# EAGLE design Breakout (EAGLE 9.6.2)
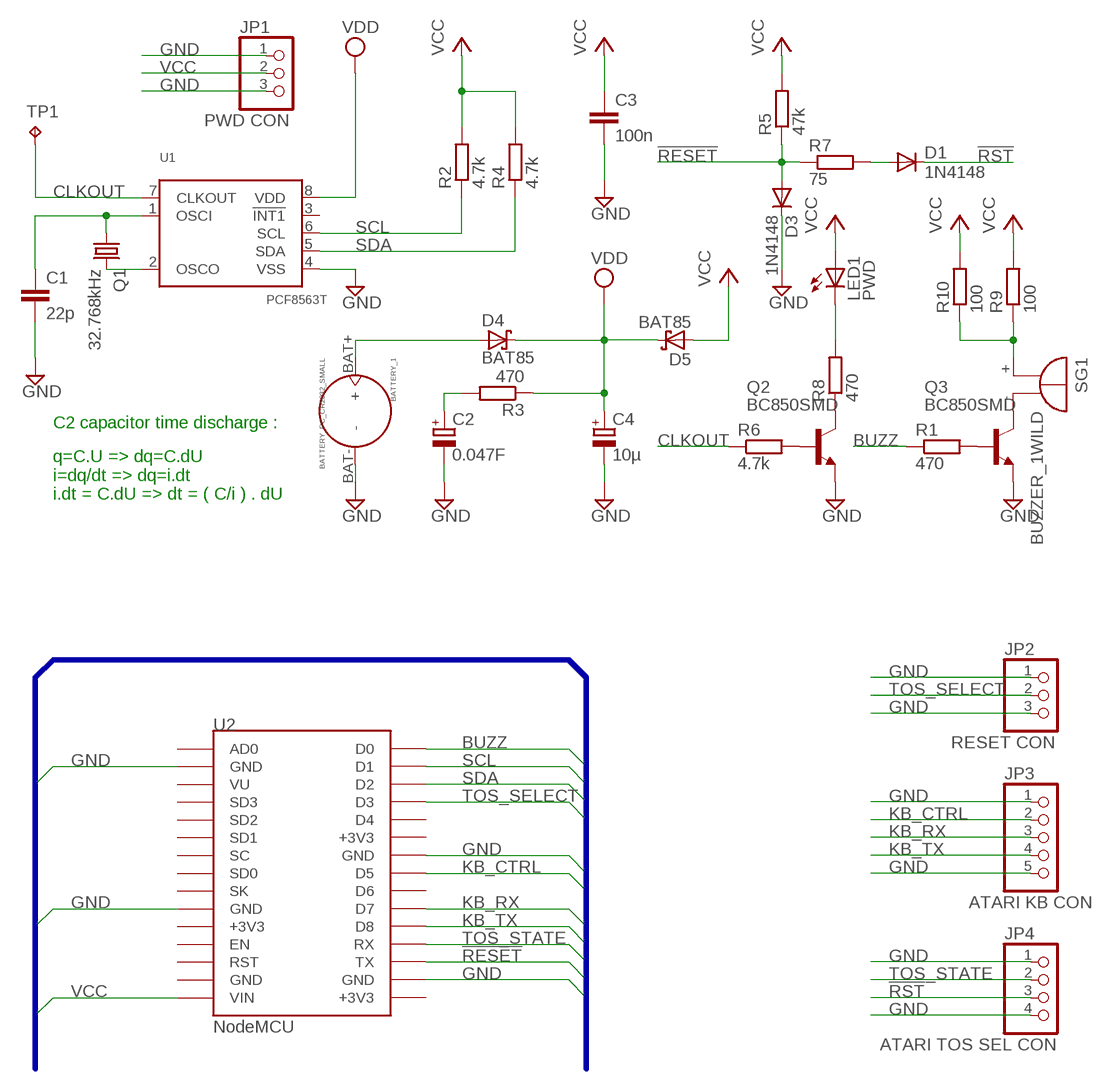
[diagram p0: schematic, sheet 1]

## Parts
BATTERY_1  BATTERY_PC_CR2032_SMALL  [BATTERY_1236_SMALL]
C1  22p  C-EU025-024X044  [C025-024X044]
C2  0.047F  SUPERCAP  [SCAP1]
C3  100n  C-EU050-025X075  [C050-025X075]
C4  10µ  CPOL-EUE2-5  [E2-5]
D1  1N4148  1N4148DO35-5  [DO35-5]
D3  1N4148  1N4148DO35-7  [DO35-7]
D4  BAT85  [DO41-10]
D5  BAT85  [DO41-10]
JP1  PWD CON  PINHD-1X3  [1X03]
JP2  RESET CON  PINHD-1X3  [1X03]
JP3  ATARI KB CON  PINHD-1X5  [1X05]
JP4  ATARI TOS SEL CON  PINHD-1X4  [1X04]
LED1  PWD  LED5MM  [LED5MM]
Q1  32.768kHz  CRYSTALTC38H  [TC38H]
Q2  BC850SMD  [SOT23-BEC]
Q3  BC850SMD  [SOT23-BEC]
R1  470  R-EU_M2012  [M2012]
R2  4.7k  R-EU_0204/7  [0204/7]
R3  470  R-EU_0204/7  [0204/7]
R4  4.7k  R-EU_0204/7  [0204/7]
R5  47k  R-EU_0204/7  [0204/7]
R6  4.7k  R-EU_0204/7  [0204/7]
R7  75  R-EU_0204/7  [0204/7]
R8  470  R-EU_M2012  [M2012]
R9  100  R-EU_M2012  [M2012]
R10  100  R-EU_0207/7  [0207/7]
SG1  BUZZER_1WILD  [F/QMBIII-W]
TP1  TPTP19SQ  [TP19SQ]
U1  PCF8563T  [SOT96-1]
U2  NodeMCU  NODE_MCU_V3DIL_WILD  [NODE_MCU_V3_WILD_DIL]

## Nets
!RESET: D3.A R5.1 R7.1 U2.TX
!RST: D1.C JP4.3
BUZZ: R1.1 U2.D0
CLKOUT: R6.1 TP1.TP U1.7(CLKOUT)
GND: BATTERY_1.BAT-(-) C1.2 C2.- C3.2 C4.- D3.C JP1.1 JP1.3 JP2.1 JP2.3 JP3.1 JP3.5 JP4.1 JP4.4 Q2.E Q3.E U1.4(VSS) U2.GND U2.GND@0(GND) U2.GND@2(GND) U2.GND@3(GND)
KB_CTRL: JP3.2 U2.D5
KB_RX: JP3.3 U2.D7
KB_TX: JP3.4 U2.D8
N$1: C1.1 Q1.1 U1.1(OSCI)
N$2: Q1.2 U1.2(OSCO)
N$3: Q2.B R6.2
N$4: LED1.K(C) R8.2
N$5: Q2.C R8.1
N$6: Q3.B R1.2
N$7: BATTERY_1.BAT+(+) D4.A
N$8: C2.+ R3.2
N$10: Q3.C SG1.-
N$13: D1.A R7.2
N$18: R9.1 R10.1 SG1.+
SCL: R2.1 U1.6(SCL) U2.D1
SDA: R4.1 U1.5(SDA) U2.D2
TOS_SELECT: JP2.2 U2.D3
TOS_STATE: JP4.2 U2.RX
VCC: C3.1 D5.A JP1.2 LED1.A R2.2 R4.2 R5.2 R9.2 R10.2 U2.VIN
VDD: C4.+ D4.C D5.C R3.1 U1.8(VDD)
Unconnected: U1.3(!INT1!) U2.3V3@0(+3V3) U2.3V3@1(+3V3) U2.3V3@2(+3V3) U2.AD0 U2.D4 U2.D6 U2.EN U2.GND@1(GND) U2.RST U2.SC U2.SD0 U2.SD1 U2.SD2 U2.SD3 U2.SK U2.VU

## Buses
+3V3,BUZZ,GND,KB_CTRL,KB_RX,KB_TX,!RESET,SCL,SDA,TOS_SELECT,TOS_STATE,VCC

## Notes on the sheet
- C2 capacitor time discharge :
- q=C.U => dq=C.dU
  i=dq/dt => dq=i.dt
  i.dt = C.dU => dt = ( C/i ) . dU

## Library data of the parts
BATTERY_1 = Custom:BATTERY_PC_CR2032: SOC004
C1 C3 = Custom:C-EU: CAPACITOR, European symbol
C2 = Custom:SUPERCAP
C4 = Custom:CPOL-EU: POLARIZED CAPACITOR, European symbol
D1 D3 = Custom:1N4148: DIODE high speed (Philips)
D4 D5 = Custom:BAT85: DIODE small signal diode
JP1 JP2 = pinhead:PINHD-1X3: PIN HEADER
JP3 = pinhead:PINHD-1X5: PIN HEADER
JP4 = pinhead:PINHD-1X4: PIN HEADER
LED1 = Custom:LED: LED OSRAM: - CHIPLED LG R971, LG N971, LY N971, LG Q971, LY Q971, LO R971, LY R971 LH N974, LH R974 LS Q976, LO Q976, LY Q976 LO Q996 - Hyper CHIPLED LW Q18S LB Q993, LB Q99A, LB R99A - SideLED LS A670, LO A670, LY A670, LG A670, LP A670 LB A673, LV A673, LT A673, LW A673 LH A674 LY A675 LS A676, LA A676, LO A676, LY A676, LW A676 LS A679, LY A679, LG A679 - Hyper Micro SIDELED® LS Y876, LA Y876, LO Y876, LY Y876 LT Y87S - SmartLED LW L88C, LW L88S LB L89C, LB L89S, LG L890 LS L89K, LO L89K, LY L89K LS L896, LA L896, LO L896, LY L896 - TOPLED LS T670, LO T670, LY T670, LG T670, LP T670 LSG T670, LSP T670, LSY T670, LOP T670, LYG T670 LG T671, LOG T671, LSG T671 LB T673, LV T673, LT T673, LW T673 LH T674 LS T676, LA T676, LO T676, LY T676, LB T676, LH T676, LSB T676, LW T676 LB T67C, LV T67C, LT T67C, LS T67K, LO T67K, LY T67K, LW E67C LS E67B, LA E67B, LO E67B, LY E67B, LB E67C, LV E67C, LT E67C LW T67C LS T679, LY T679, LG T679 LS T770, LO T770, LY T770, LG T770, LP T770 LB T773, LV T773, LT T773, LW T773 LH T774 LS E675, LA E675, LY E675, LS T675 LS T776, LA T776, LO T776, LY T776, LB T776 LHGB T686 LT T68C, LB T68C - Hyper Mini TOPLED® LB M676 - Mini TOPLED Santana® LG M470 LS M47K, LO M47K, LY M47K Source: http://www.osram.convergy.de LUXEON: - LUMILED® LXK2-PW12-R00, LXK2-PW12-S00, LXK2-PW14-U00, LXK2-PW14-V00 LXK2-PM12-R00, LXK2-PM12-S00, LXK2-PM14-U00 LXK2-PE12-Q00, LXK2-PE12-R00, LXK2-PE12-S00, LXK2-PE14-T00, LXK2-PE14-U00 LXK2-PB12-K00, LXK2-PB12-L00, LXK2-PB12-M00, LXK2-PB14-N00, LXK2-PB14-P00, LXK2-PB14-Q00 LXK2-PR12-L00, LXK2-PR12-M00, LXK2-PR14-Q00, LXK2-PR14-R00 LXK2-PD12-Q00, LXK2-PD12-R00, LXK2-PD12-S00 LXK2-PH12-R00, LXK2-PH12-S00 LXK2-PL12-P00, LXK2-PL12-Q00, LXK2-PL12-R00 Source: www.luxeon.com KINGBRIGHT: KA-3528ASYC Source: www.kingbright.com
Q1 = Custom:CRYSTAL: CRYSTAL; OC_FARNELL: unknown; OC_NEWARK: unknown
Q2 Q3 = Custom:BC850*: NPN Transistor
R1-R10 = Custom:R-EU_: RESISTOR, European symbol
SG1 = Custom:BUZZER_1: BUZZER Source: Buerklin
TP1 = testpad:TP: Test pad
U1 = NXP_60_26022015:PCF8563: Real time clock/calendar The PCF8563 is a CMOS Real-Time Clock (RTC) and calendar optimized for low power consumption. A programmable clock output, interrupt output, and voltage-low detector are also provided. All addresses and data are transferred serially via a two-line bidirectional I2C-bus. Maximum bus speed is 400 kbit/s. The register address is incremented automatically after each written or read data byte. AAL Eindhoven MK
U2 = ESP12E_DEVKIT:NODE_MCU_V3: ESP12E DEVKIT BOARD

## Board
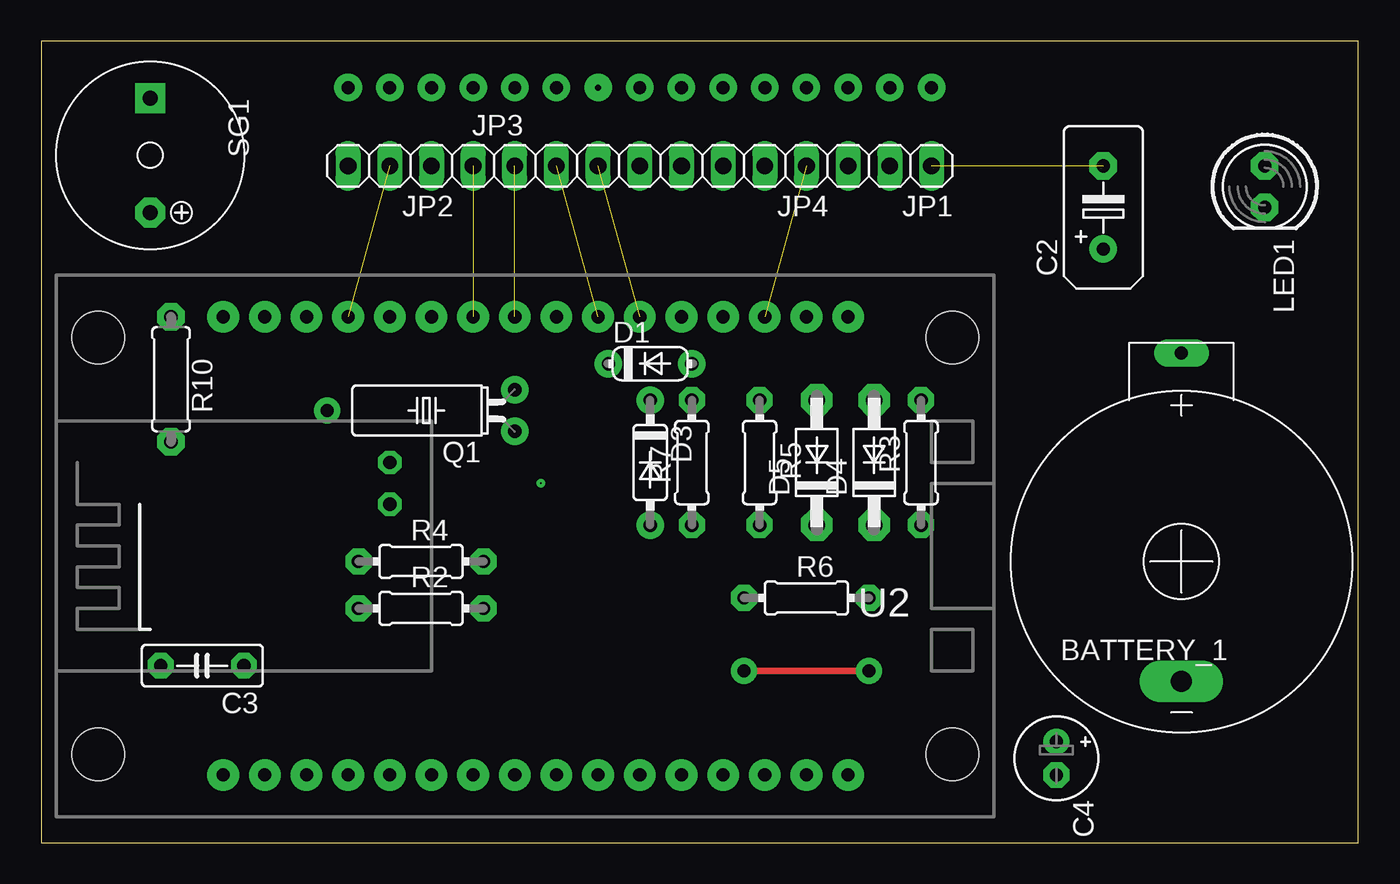
[diagram p1: board, top side]
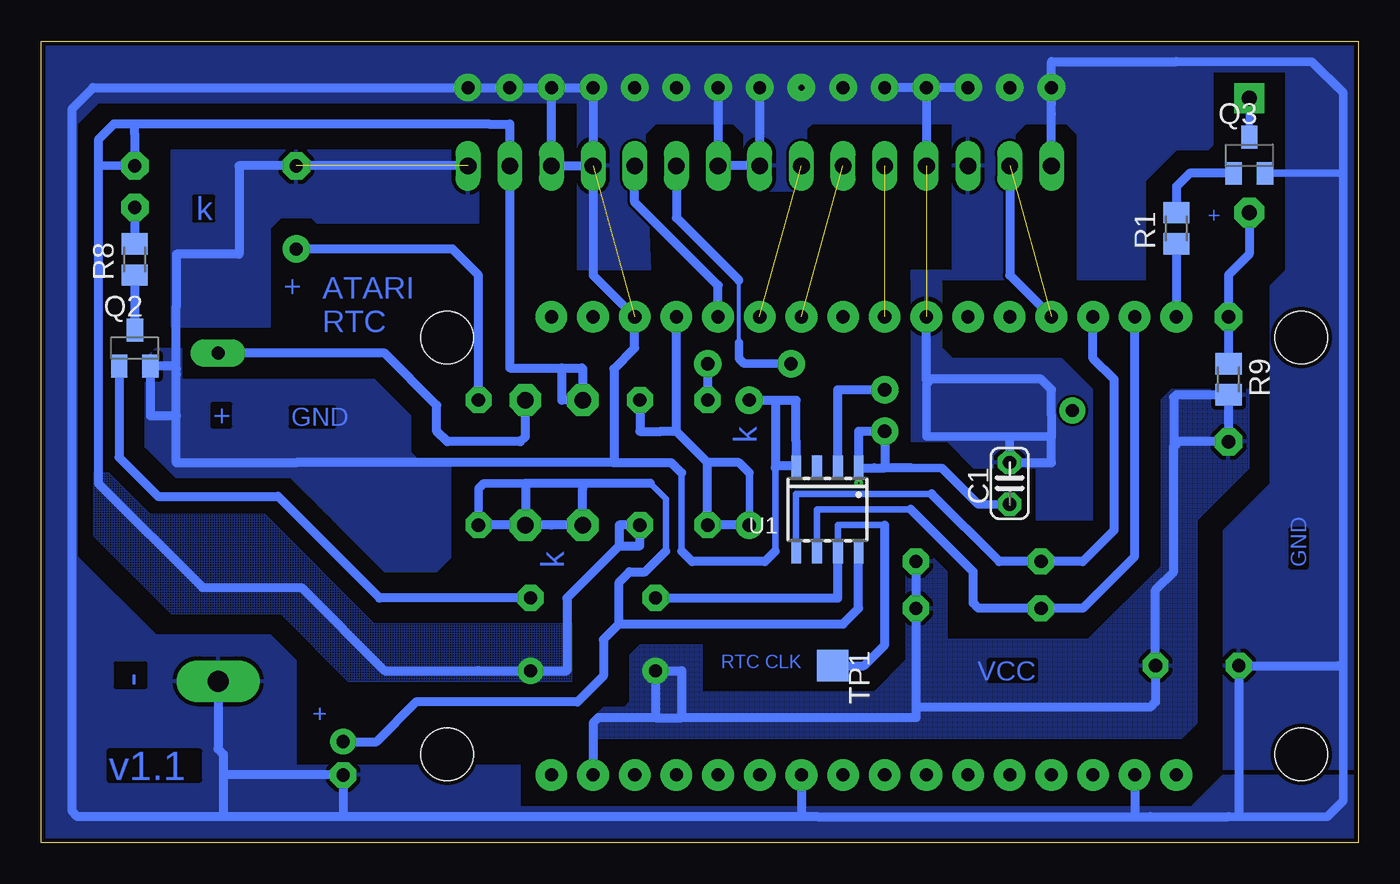
[diagram p2: board, bottom side, seen from below]

Size 80.32 x 48.88 mm. Coordinates in mm from the lower left corner, seen from the top.
Outline: 80.32,0 80.32,48.88 0,48.88 0,0 80.32,0
Copper layers (1*16): Top 0.035mm / dielectric 1.5mm / Bottom 0.035mm
Design rules "default *": minimum track width 10mil, minimum drill 0.35mm, track to track 6mil, track to pad 6mil, pad to pad 6mil, via to via 6mil, smd to smd 6mil, copper to edge 10mil, drill to drill 6mil, minimum pad ring 10mil, minimum via ring 8mil, stop-mask expansion 4mil, vias tented up to drill 0mil, thermal gap 10mil

### Footprints (pad centres in the part's own frame; a part is rotated, then mirrored left to right if it is on the bottom)
BATTERY_1236_SMALL = drill 0.8 pad 1.676 long: BAT+ 0,-0.635 | drill 1.27 pad 2.54 long: BAT- 0,19.367
C025-024X044 = drill 0.813 pad 1.422 octagon: 1 -1.27,0; 2 1.27,0
SCAP1 = drill 0.813 pad 1.676: + -7.62,0 | drill 0.813 pad 1.676 octagon: - -2.54,0
C050-025X075 = drill 0.813 pad 1.575 octagon: 1 -2.54,0; 2 2.54,0
E2-5 = drill 0.813 pad 1.575: + -1.016,0 | drill 0.813 pad 1.575 octagon: - 1.016,0
DO35-5 = drill 0.813 pad 1.676: A 2.54,0; C -2.54,0
DO35-7 = drill 0.813 pad 1.676: A 3.81,0; C -3.81,0
DO41-10 = drill 1 pad 1.93 octagon: A 3.81,0; C -3.81,0
1X03 = drill 1.016 long: 1 -2.54,0; 2 0,0; 3 2.54,0
1X05 = drill 1.016 long: 1 -5.08,0; 2 -2.54,0; 3 0,0; 4 2.54,0; 5 5.08,0
1X04 = drill 1.016 long: 1 -3.81,0; 2 -1.27,0; 3 1.27,0; 4 3.81,0
LED5MM = drill 0.813 pad 1.676 octagon: A -1.27,0; K 1.27,0
TC38H = drill 0.813 pad 1.676: 1 -1.27,0; 2 1.27,0
SOT23-BEC = smd 1 x 1.4: B -0.95,-1.1; C 0,1.1; E 0.95,-1.1
M2012 = smd 1.3 x 1.6: 1 -0.95,0; 2 0.95,0
0204/7 = drill 0.813 pad 1.575 octagon: 1 -3.81,0; 2 3.81,0
0207/7 = drill 0.813 pad 1.676 octagon: 1 -3.81,0; 2 3.81,0
F/QMBIII-W = drill 0.914 pad 1.829 octagon: + 3.493,0 | drill 0.914 pad 1.829 square: - -3.493,0
TP19SQ = smd 1.9 x 1.9: TP 0,0
SOT96-1 = smd 0.6 x 1.3: 1 -1.905,-2.65; 2 -0.635,-2.65; 3 0.635,-2.65; 4 1.905,-2.65; 5 1.905,2.65; 6 0.635,2.65; 7 -0.635,2.65; 8 -1.905,2.65
NODE_MCU_V3_WILD_DIL = drill 0.8 pad 1.93: 3V3@0 -13.97,-11.43; 3V3@1 13.97,1.27; 3V3@2 13.97,-21.59; AD0 -13.97,13.97; D0 13.97,13.97; D1 13.97,11.43; D2 13.97,8.89; D3 13.97,6.35; D4 13.97,3.81; D5 13.97,-3.81; D6 13.97,-6.35; D7 13.97,-8.89; D8 13.97,-11.43; EN -13.97,-13.97; GND -13.97,11.43; GND@0 -13.97,-8.89; GND@1 -13.97,-19.05; GND@2 13.97,-19.05; GND@3 13.97,-1.27; NC@0 -13.97,-24.13; NC@2 13.97,-24.13; RST -13.97,-16.51; RX 13.97,-13.97; SC -13.97,-1.27; SD0 -13.97,-3.81; SD1 -13.97,1.27; SD2 -13.97,3.81; SD3 -13.97,6.35; SK -13.97,-6.35; TX 13.97,-16.51; VIN -13.97,-21.59; VU -13.97,8.89 | hole 3.2: -12.7,21.59; 12.7,21.59; -12.7,-30.48; 12.7,-30.48

### Placement (x,y rotation side)
BATTERY_1  69.52,29.21 180 top
C1  21.26,21.91 90 bottom
C2  64.76,43.81 90 top
C3  9.83,10.79 180 top
C4  61.9,5.14 270 top
D1  37.14,29.21 0 top
D3  37.14,23.18 270 top
D4  50.79,23.18 90 top
D5  47.3,23.18 90 top
JP1  51.74,41.27 180 top
JP2  21.26,41.27 180 top
JP3  31.42,41.27 0 top
JP4  42.85,41.27 180 top
LED1  74.6,40.01 270 top
Q1  28.88,26.35 90 top
Q2  74.6,30.16 0 bottom
Q3  6.66,41.91 0 bottom
R1  11.1,37.47 90 bottom
R2  23.17,14.29 0 top
R3  53.65,23.18 90 top
R4  23.17,17.14 0 top
R5  43.8,23.18 270 top
R6  46.66,14.92 0 top
R7  39.68,23.18 90 top
R8  74.6,35.56 90 bottom
R9  7.93,28.26 270 bottom
R10  7.93,28.26 270 top
SG1  6.66,41.91 270 top
TP1  32.06,10.79 270 bottom
U1  32.38,20.32 180 bottom
U2  25.07,18.1 90 top

### Tracks (layer width: path | path; a pad name or v marks a point on that pad's centre or on a via)
!RESET
  Bottom 0.457: 37.14,22.54 D3.A
  Bottom 0.559: 37.14,22.54 37.77,23.18 39.68,23.18 | 39.68,23.18 41.58,25.08 | 41.58,25.08 42.54,25.08 43.8,25.08 R5.1 | D3.A R7.1 39.68,23.18 | 41.58,25.08 U2.TX
!RST
  Bottom 0.254: 37.77,30.48 37.77,34.29
  Bottom 0.508: D1.C 37.45,29.21 37.77,29.53 37.77,30.48
  Bottom 0.559: JP4.3 41.58,38.1 37.77,34.29
BUZZ
  Bottom 0.559: R1.1 U2.D0
CLKOUT
  Bottom 0.406: 28.88,19.37 31.74,19.37 U1.7
  Bottom 0.559: R6.1 31.74,14.92 U1.7 | TP1.TP 30.15,10.79 28.88,12.06 28.88,19.37
GND  (via drill 0.35 pad 1.68, 0.79 pad 1.68)  (3 unrouted)
  Bottom 0.406: 34.28,23.5 U1.4 | 35.55,17.78 35.55,22.86 35.44,22.97 | 41.27,17.78 41.27,22.54
  Bottom 0.457: 0.94,40.81 Q3.E
  Bottom 0.508: 26.03,28.26 26.34,27.94 26.34,24.77 21.26,24.77 18.72,24.77 | 7.93,1.59 7.29,1.59 5.71,1.59 1.89,1.59 0.94,2.54 0.94,5.08 0.94,10.79 0.94,39.69 0.94,40.64 0.94,41.27 | 0.94,41.27 0.94,45.72 2.85,47.62 11.1,47.62 | 0.94,41.27 0.94,40.81
  Bottom 0.559: 13.64,1.59 33.01,1.59 33.96,1.59 | 13.64,1.59 12.69,1.59 7.93,1.59 | 61.9,1.59 C4.- 69.2,4.13 69.2,5.4 | v49.2,46.04 v51.74,46.04 v54.28,46.04 77.14,46.04 78.41,44.77 78.41,1.91 78.09,1.59 69.2,1.59 | v49.2,46.04 v46.66,46.04 46.66,44.77 46.66,44.45 46.66,41.91 JP4.1 | 69.2,1.59 66.98,1.59 62.22,1.59 61.9,1.59 | 34.28,23.5 34.28,24.45 34.28,26.99 35.55,26.99 | D3.C 35.87,26.99 35.55,26.99 | 35.55,17.78 36.19,17.14 40.63,17.14 41.27,17.78 | 41.27,22.54 41.9,23.18 45.39,23.18 | 35.55,26.99 35.55,22.86 | 45.39,23.18 64.76,23.18 72.06,23.18 72.06,26.04 | v28.88,46.04 28.57,46.04 v26.34,46.04 | JP2.3 18.72,44.45 18.72,45.09 v18.72,46.04 18.72,46.36 18.72,47.62 11.1,47.62 | v23.8,46.04 v26.34,46.04 | 45.39,23.18 45.39,28.89 44.12,30.16 U2.GND@2 46.66,34.61 JP4.1 | U1.4 35.44,22.97 | v39.04,46.04 39.04,43.5 JP4.4 JP3.5 v36.5,46.04 | v26.34,46.04 JP3.1 | v49.2,46.04 JP1.3 JP4.1 | U2.GND 13.64,1.59 | 0.94,10.79 1.26,10.79 C3.2 7.29,1.59 | U2.GND@3 26.34,28.26 26.03,28.26 19.36,28.26 18.72,27.62 18.72,26.04 18.72,24.77 18.72,23.18 C1.2 21.26,24.77 | 33.96,1.59 44.12,1.59 61.9,1.59 | 72.06,26.04 72.38,26.04 73.65,26.04 Q2.E 72.23,29.06 72.06,28.89 | BATTERY_1.BAT- 69.52,5.71 69.2,5.4 | 69.2,5.4 69.2,5.08 69.2,1.59 | JP1.1 C2.- 68.25,41.27 68.25,35.88 72.06,35.88 72.06,32.7 72.06,28.89 | 72.06,26.04 72.06,28.58 72.06,28.89 | U2.GND@0 33.96,1.59
  other vias: 41.58,46.04 44.12,46.04 33.96,46.04 31.42,46.04 21.26,46.04
  pour Bottom: -0.01,0 80.32,0 80.32,48.9 -0.01,48.9 -0.01,4.45 8.24,4.45 8.24,19.05 5.39,21.91 5.39,33.97 4.43,34.93 4.43,46.99 8.88,46.99 8.88,42.55 9.2,42.23 11.1,42.23 13.01,40.32 13.01,34.29 17.14,34.29 17.14,43.18 17.77,43.81 20.31,43.81 20.95,43.18 20.95,34.61 21.26,34.29 27.3,34.29 27.3,34.93 24.76,34.93 24.76,43.81 33.33,43.81 33.64,43.5 33.64,39.69 37.45,39.69 37.45,43.18 38.09,43.81 42.85,43.81 43.49,43.18 43.17,34.93 47.62,34.93 47.62,45.09 76.83,45.09 78.09,43.81 78.09,17.46 73.33,12.7 66.35,12.7 64.76,11.11 64.76,4.76 51.11,4.76 51.11,2.22 10.15,2.22 8.24,4.13 -0.01,4.13
  pour Bottom: 57.14,23.18 55.34,23.18 55.34,17.36 56.19,16.51 59.36,16.51 65.08,22.23 72.06,22.23 73.97,24.13 73.97,29.53 73.33,30.16 71.75,30.16 71.75,28.26 60,28.26 57.77,26.04 57.77,23.81
  pour Bottom: 16.18,19.69 16.18,27.62 18.09,29.53 24.76,29.53 25.39,30.16 25.39,34.29 27.3,34.29 27.3,24.45 25.07,24.45 23.48,22.86 19.68,22.86 19.68,19.69
  pour Bottom: 63.49,37.78 53.65,37.78 53.65,42.23 72.38,42.23 72.38,31.43 66.35,31.43 66.35,37.47 65.71,38.1 63.81,38.1
KB_CTRL  (1 unrouted)
KB_RX  (1 unrouted)
KB_TX  (1 unrouted)
N$1
  Bottom 0.406: U1.1 30.36,22.86 U1.1
  Bottom 0.508: 27.3,22.86 25.39,22.86 23.17,20.64 C1.1
  Bottom 0.559: U1.1 30.47,25.08 Q1.1 28.88,22.86 | 27.3,22.86 28.88,22.86 | 30.36,22.86 29.52,22.86 28.88,22.86
N$2
  Bottom 0.559: U1.2 31.74,27.62 Q1.2
N$3
  Bottom 0.559: R6.2 59.68,14.92 65.87,21.11 73.17,21.11 75.55,23.49 Q2.B
N$4
  Bottom 0.559: LED1.K R8.2
N$5
  Bottom 0.559: R8.1 Q2.C
N$6
  Bottom 0.559: Q3.B 10.3,40.81 11.1,40.01 R1.2
N$7
  Bottom 0.559: D4.A 50.79,24.77 51.11,24.45 55.55,24.45 56.19,25.08 56.19,26.67 59.36,29.85 BATTERY_1.BAT+
N$8
  Bottom 0.559: R3.2 53.65,28.89 53.65,34.61 55.23,36.2 58.41,36.2 C2.+
N$9  (via drill 0.8 pad 1.57)
  other vias: 17.45,26.35
N$10
  Bottom 0.457: SG1.- Q3.C
N$11  (via drill 0.1 pad 0.2)
  other vias: 30.47,21.91
N$13
  Bottom 0.559: D1.A R7.2
N$14  (via drill 0.79 pad 1.68)
  other vias: 3.48,30.8
N$15  (via drill 0.79 pad 1.68)
  other vias: 3.48,5.4
N$16  (via drill 0.79 pad 1.68)
  other vias: 55.55,5.4
N$17  (via drill 0.79 pad 1.68)
  other vias: 55.55,30.8
N$18
  Bottom 0.559: R9.1 R10.1 7.93,34.61 6.66,35.88 SG1.+
SCL
  Bottom 0.406: U1.6 33.01,20.32 27.3,20.32
  Bottom 0.559: 27.3,20.32 23.48,16.51 23.48,14.6 23.17,14.29 R2.1 16.82,14.29 13.64,17.46 U2.D1
SDA
  Bottom 0.406: U1.5 34.28,21.27 26.03,21.27
  Bottom 0.559: 26.03,21.27 21.9,17.14 R4.1 16.82,17.14 14.91,19.05 14.91,28.26 16.18,29.53 U2.D2
TOS_SELECT  (1 unrouted)
  Bottom 0.559: JP2.2 21.26,34.61 U2.D3
TOS_STATE
  Bottom 0.559: JP4.2 44.12,39.05 39.04,33.97 U2.RX
VCC  (via drill 0.79 pad 1.57)
  Top 0.406: v50.47,10.48 v42.85,10.48
  Bottom 0.508: LED1.A 76.51,41.27 76.83,41.27 | 47.35,28.95 47.3,28.89
  Bottom 0.559: 26.98,8.25 26.98,11.43 R2.2 R4.2 | 26.98,8.25 26.98,7.62 41.27,7.62 | 48.57,28.95 51.74,28.95 JP1.2 51.74,43.81 53.01,43.81 74.28,43.81 74.6,43.81 | 42.85,7.62 41.27,7.62 | 45.08,18.1 45.08,19.37 R5.2 43.8,18.1 45.08,18.1 | 45.08,18.1 48.25,14.92 48.25,10.48 v50.47,10.48 53.65,10.48 59.36,10.48 64.44,15.56 70.47,15.56 76.83,21.91 76.83,27.94 76.83,28.58 76.83,29.53 76.83,39.37 76.83,40.96 76.83,41.27 76.83,42.86 75.87,43.81 74.92,43.81 74.6,43.81 | 41.27,7.62 41.27,8.25 41.27,10.48 v42.85,10.48 42.85,8.25 42.85,7.62 | LED1.A 74.6,43.18 74.6,43.81 | 11.26,24.13 11.26,16.51 12.37,15.4 C3.1 12.37,8.57 12.69,8.25 26.98,8.25 | 48.57,28.95 48.57,26.99 D5.A 47.3,28.89 | 48.57,28.95 47.35,28.95 | U2.VIN 46.66,7.3 46.34,7.62 42.85,7.62 | 11.26,24.13 10.94,24.45 R10.2 R9.2 11.1,27.3 11.26,27.15 11.26,24.13
  pour Bottom (isolate 0.051, hatched): 9.83,7.3 9.83,19.69 6.66,22.86 6.66,27.62 11.42,27.62 12.05,26.99 12.05,16.83 16.5,12.38 25.07,12.38 25.07,16.51 26.34,17.78 27.61,17.78 27.61,11.11 29.52,9.21 40,9.21 40,12.06 43.8,12.06 44.44,11.43 44.44,8.57 44.76,8.25 46.03,8.25 46.66,7.62 46.66,6.35 10.79,6.35
  pour Bottom (isolate 0.102, hatched): 66.67,20 73.65,20 76.19,22.54 77.14,22.54 77.14,18.73 72.38,13.97 65.71,13.97 61.59,9.84 47.93,9.84 47.93,13.33 60,13.33
VDD
  Bottom 0.406: 47.3,21.59 47.3,21.91 | 43.17,21.91 42.22,20.96 42.22,17.78
  Bottom 0.508: 50.79,21.91 53.33,21.91 53.65,21.59 R3.1
  Bottom 0.559: 45.08,13.33 46.03,12.38 46.03,10.16 47.62,8.57 57.46,8.57 59.87,6.16 C4.+ | 45.08,13.33 42.54,13.33 | D4.C 49.2,19.37 D5.C 47.3,21.59 | D4.C R3.1 | U1.8 30.47,14.29 31.42,13.33 40.63,13.33 42.54,13.33 | D4.C 50.79,21.91 47.3,21.91 43.17,21.91 | 45.08,13.33 42.54,13.33 | 42.22,17.78 43.49,16.51 44.44,16.51 45.08,15.88 45.08,13.33

### Text on the board
Bottom: k | + | + | ATARI / RTC | k | GND | + | k | GND | RTC CLK | VCC | - | + | v1.1